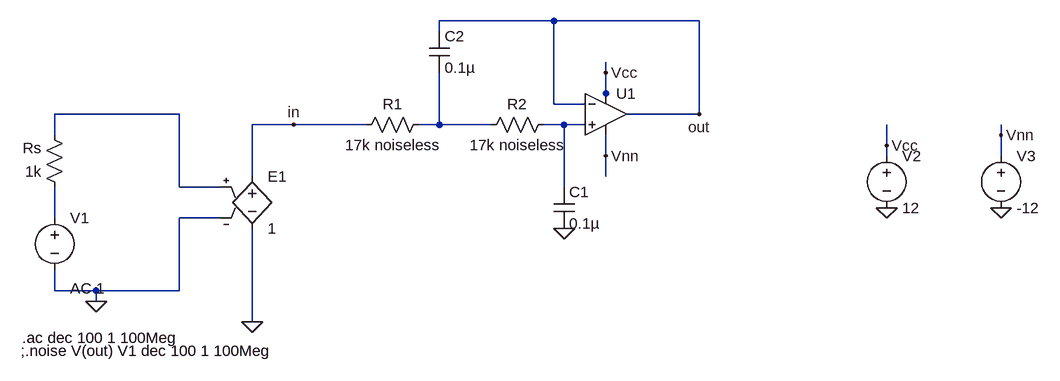
[diagram p0: schematic homework-1-d.asc]
homework-1-d.asc, the LTspice schematic file:
Version 4
SHEET 1 1668 680
WIRE 912 -80 736 -80
WIRE 1136 -80 912 -80
WIRE 736 -64 736 -80
WIRE 992 0 992 -16
WIRE 992 32 992 0
WIRE 912 48 912 -80
WIRE 960 48 912 48
WIRE 992 48 992 32
WIRE 336 64 144 64
WIRE 1136 64 1136 -80
WIRE 1136 64 1024 64
WIRE 512 80 448 80
WIRE 624 80 512 80
WIRE 736 80 736 0
WIRE 736 80 704 80
WIRE 816 80 736 80
WIRE 928 80 896 80
WIRE 960 80 928 80
WIRE 144 96 144 64
WIRE 1600 96 1600 80
WIRE 1424 112 1424 80
WIRE 992 128 992 96
WIRE 1424 128 1424 112
WIRE 1600 128 1600 96
WIRE 448 160 448 80
WIRE 992 160 992 128
WIRE 336 176 336 64
WIRE 400 176 336 176
WIRE 928 176 928 80
WIRE 144 224 144 176
WIRE 400 224 336 224
WIRE 144 336 144 304
WIRE 208 336 144 336
WIRE 336 336 336 224
WIRE 336 336 208 336
WIRE 208 352 208 336
WIRE 448 384 448 240
FLAG 208 352 0
FLAG 448 384 0
FLAG 512 80 in
FLAG 928 240 0
FLAG 1424 208 0
FLAG 1600 208 0
FLAG 992 128 Vnn
FLAG 992 0 Vcc
FLAG 1424 112 Vcc
FLAG 1600 96 Vnn
FLAG 1136 64 out
SYMBOL res 160 192 R180
WINDOW 0 36 76 Left 2
WINDOW 3 36 40 Left 2
SYMATTR InstName Rs
SYMATTR Value 1k
SYMBOL e 448 144 R0
SYMATTR InstName E1
SYMATTR Value 1
SYMBOL voltage 144 208 R0
WINDOW 123 24 124 Left 2
WINDOW 39 0 0 Left 0
SYMATTR InstName V1
SYMATTR Value ""
SYMATTR Value2 AC 1
SYMBOL OpAmps\\UniversalOpamp2 992 64 R0
SYMATTR InstName U1
SYMBOL res 720 64 R90
WINDOW 0 0 56 VBottom 2
WINDOW 3 32 56 VTop 2
SYMATTR InstName R1
SYMATTR Value 17k noiseless
SYMBOL res 912 64 R90
WINDOW 0 0 56 VBottom 2
WINDOW 3 32 56 VTop 2
SYMATTR InstName R2
SYMATTR Value 17k noiseless
SYMBOL cap 912 176 R0
SYMATTR InstName C1
SYMATTR Value 0.1µ
SYMBOL cap 720 -64 R0
SYMATTR InstName C2
SYMATTR Value 0.1µ
SYMBOL voltage 1424 112 R0
WINDOW 123 0 0 Left 0
WINDOW 39 0 0 Left 0
SYMATTR InstName V2
SYMATTR Value 12
SYMBOL voltage 1600 112 R0
WINDOW 123 0 0 Left 0
WINDOW 39 0 0 Left 0
SYMATTR InstName V3
SYMATTR Value -12
TEXT 94 408 Left 2 !.ac dec 100 1 100Meg
TEXT 92 428 Left 2 !;.noise V(out) V1 dec 100 1 100Meg

The netlist it stands for:
* homework-1-d.asc
Rs N004 N001 1k
E1 in 0 N001 0 1
V1 N004 0 AC 1
XU1 N003 out Vcc Vnn out level.2 Avol=1Meg GBW=10Meg Slew=10Meg ilimit=25m rail=0 Vos=0 phimargin=45 en=0 enk=0 in=0 ink=0 Rin=500Meg  ; pins IN+ IN- V+ V- OUT
R1 N002 in 17k noiseless
R2 N003 N002 17k noiseless
C1 N003 0 0.1µ
C2 out N002 0.1µ
V2 Vcc 0 12
V3 Vnn 0 -12
.ac dec 100 1 100Meg
;.noise V(out) V1 dec 100 1 100Meg
.lib UniversalOpamps2.sub
.backanno
.end